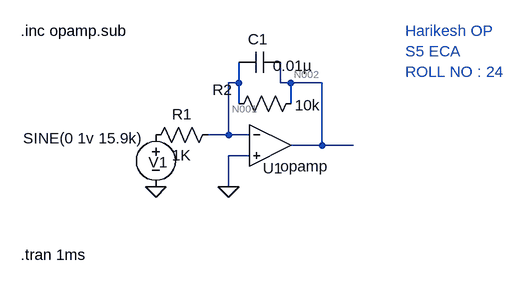
[diagram p0: schematic INTEGRATOR.asc]
INTEGRATOR.asc, the LTspice schematic file:
Version 4
SHEET 1 880 680
WIRE 192 64 192 32
WIRE 192 64 176 64
WIRE 256 64 256 32
WIRE 272 64 256 64
WIRE 320 64 272 64
WIRE 192 96 192 64
WIRE 272 96 272 64
WIRE 176 144 176 64
WIRE 176 144 144 144
WIRE 208 144 176 144
WIRE 320 160 320 64
WIRE 320 160 272 160
WIRE 368 160 320 160
WIRE 208 176 176 176
WIRE 176 224 176 176
FLAG 176 224 0
FLAG 64 224 0
SYMBOL OpAmps\\opamp 240 96 R0
WINDOW 0 -11 99 Left 2
SYMATTR InstName U1
SYMBOL voltage 64 128 R0
WINDOW 123 0 0 Left 0
WINDOW 39 0 0 Left 0
WINDOW 0 -11 58 Left 2
WINDOW 3 -204 21 Left 2
SYMATTR InstName V1
SYMATTR Value SINE(0 1v 15.9k)
SYMBOL res 160 128 R90
WINDOW 0 0 56 VBottom 2
WINDOW 3 32 56 VTop 2
SYMATTR InstName R1
SYMATTR Value 1K
SYMBOL cap 256 16 R90
WINDOW 0 -4 35 VBottom 2
WINDOW 3 6 -19 VTop 2
SYMATTR InstName C1
SYMATTR Value 0.01µ
SYMBOL res 288 80 R90
WINDOW 0 10 121 VBottom 2
WINDOW 3 3 -10 VTop 2
SYMATTR InstName R2
SYMATTR Value 10k
TEXT -144 -16 Left 2 !.inc opamp.sub
TEXT 448 -16 Left 2 ;Harikesh OP\nS5 ECA \nROLL NO : 24
TEXT -144 328 Left 2 !.tran 1ms

The netlist it stands for:
* INTEGRATOR.asc
XU1 N001 0 N002 opamp Aol=100K GBW=10Meg  ; pins invin noninvin out
V1 P001 0 SINE(0 1v 15.9k)
R1 N001 P001 1K
C1 N002 N001 0.01µ
R2 N002 N001 10k
.inc opamp.sub
* Harikesh OP
* S5 ECA
* ROLL NO : 24
.tran 1ms
.backanno
.end

* Results of the author's LTspice run, read from the files saved beside the schematic
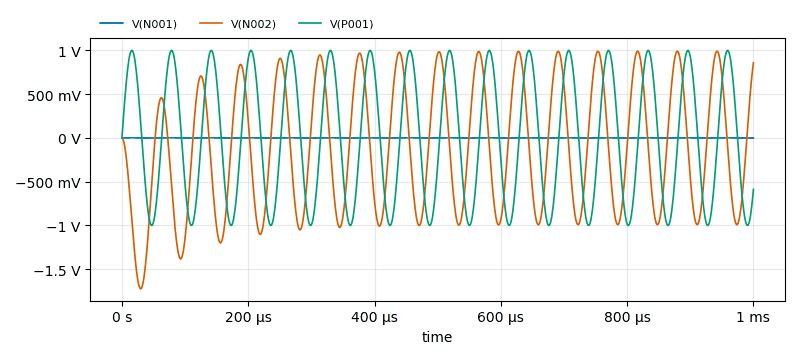
[diagram p1: Transient Analysis of INTEGRATOR.asc, plotted from the saved traces]
* Transient Analysis, 1 run:
*   V(N001): min -1.67 mV, max 1.577 mV, average -12.6 µV, rms 1.117 mV, last -808.4 µV
*   V(N002): min -1.723 V, max 991 mV, average -105 mV, rms 733.2 mV, last 857.1 mV
*   V(P001): min -1 V, max 1 V, average 1.91 mV, rms 708.8 mV, last -587.8 mV